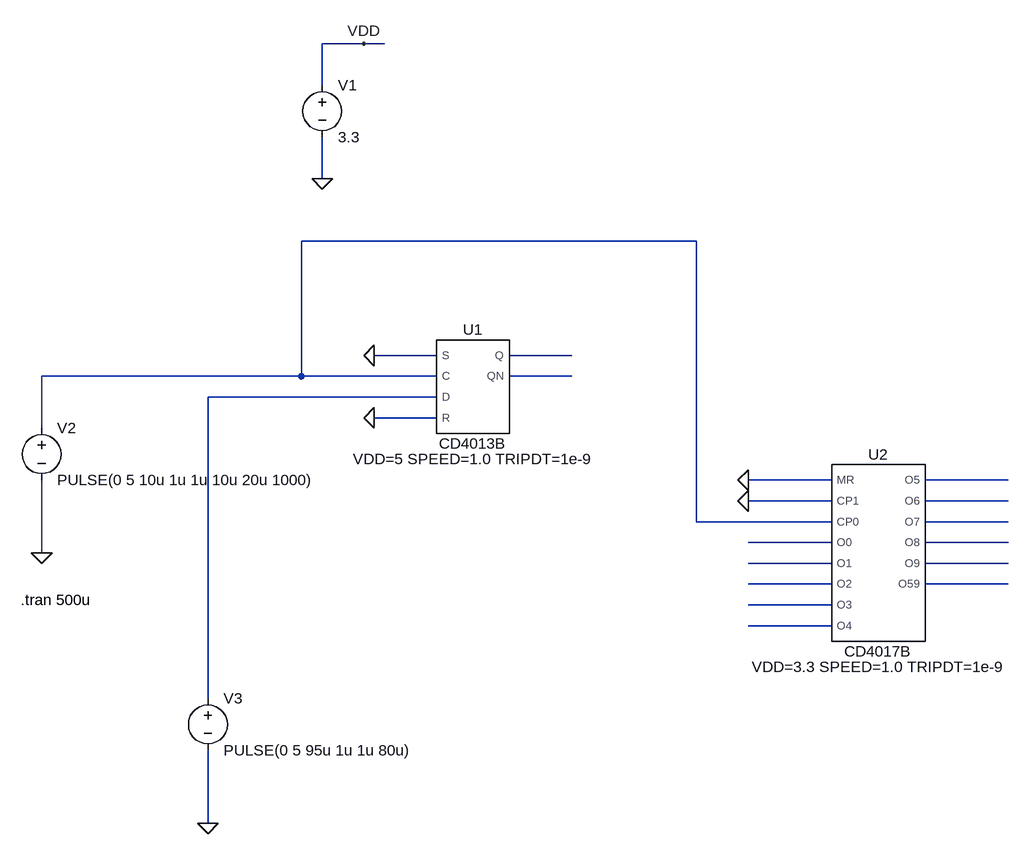
[diagram p0: schematic test.asc]
test.asc, the LTspice schematic file:
Version 4
SHEET 1 1572 852
WIRE 16 -368 -48 -368
WIRE 48 -368 16 -368
WIRE -48 -304 -48 -368
WIRE -48 -160 -48 -224
WIRE 528 -64 -80 -64
WIRE 128 112 32 112
WIRE 336 112 240 112
WIRE -80 144 -80 -64
WIRE -80 144 -480 144
WIRE 128 144 -80 144
WIRE 336 144 240 144
WIRE 128 176 -224 176
WIRE 128 208 32 208
WIRE -480 224 -480 144
WIRE 736 304 608 304
WIRE 1008 304 880 304
WIRE 736 336 608 336
WIRE 1008 336 880 336
WIRE 528 368 528 -64
WIRE 736 368 528 368
WIRE 1008 368 880 368
WIRE 736 400 608 400
WIRE 1008 400 880 400
WIRE -480 416 -480 304
WIRE 736 432 608 432
WIRE 1008 432 880 432
WIRE 736 464 608 464
WIRE 1008 464 880 464
WIRE 736 496 608 496
WIRE 736 528 608 528
WIRE -224 640 -224 176
WIRE -224 832 -224 720
FLAG -48 -160 0
FLAG 16 -368 VDD
FLAG 32 208 0
FLAG -480 416 0
FLAG 32 112 0
FLAG -224 832 0
FLAG 608 304 0
FLAG 608 336 0
SYMBOL voltage -48 -320 R0
SYMATTR InstName V1
SYMATTR Value 3.3
SYMBOL voltage -480 208 R0
WINDOW 123 0 0 Left 0
WINDOW 39 0 0 Left 0
SYMATTR InstName V2
SYMATTR Value PULSE(0 5 10u 1u 1u 10u 20u 1000)
SYMBOL voltage -224 624 R0
WINDOW 123 0 0 Left 0
WINDOW 39 0 0 Left 0
SYMATTR InstName V3
SYMATTR Value PULSE(0 5 95u 1u 1u 80u)
SYMBOL CD4013B 176 160 R0
SYMATTR InstName U1
SYMBOL CD4017B 800 416 R0
SYMATTR InstName U2
SYMATTR SpiceLine VDD=3.3 SPEED=1.0 TRIPDT=1e-9
TEXT -512 488 Left 2 !.tran 500u

The netlist it stands for:
* test.asc
V1 VDD 0 3.3
V2 N001 0 PULSE(0 5 10u 1u 1u 10u 20u 1000)
V3 N004 0 PULSE(0 5 95u 1u 1u 80u)
XU1 0 N001 N004 0 N002 N003 VDD 0 CD4013B VDD=5 SPEED=1.0 TRIPDT=1e-9  ; pins S C D R Q QN
XU2 0 0 N001 N008 N010 N012 N014 N015 N005 N006 N007 N009 N011 N013 VDD 0 CD4017B VDD=3.3 SPEED=1.0 TRIPDT=1e-9  ; pins MR CP1 CP0 O0 O1 O2 O3 O4 O5 O6 O7 O8 O9 O59
.tran 500u
.lib CD4000_v.lib
.backanno
.end